# Altium schematic sheet PC CONNECTIONS.SchDoc
size A4
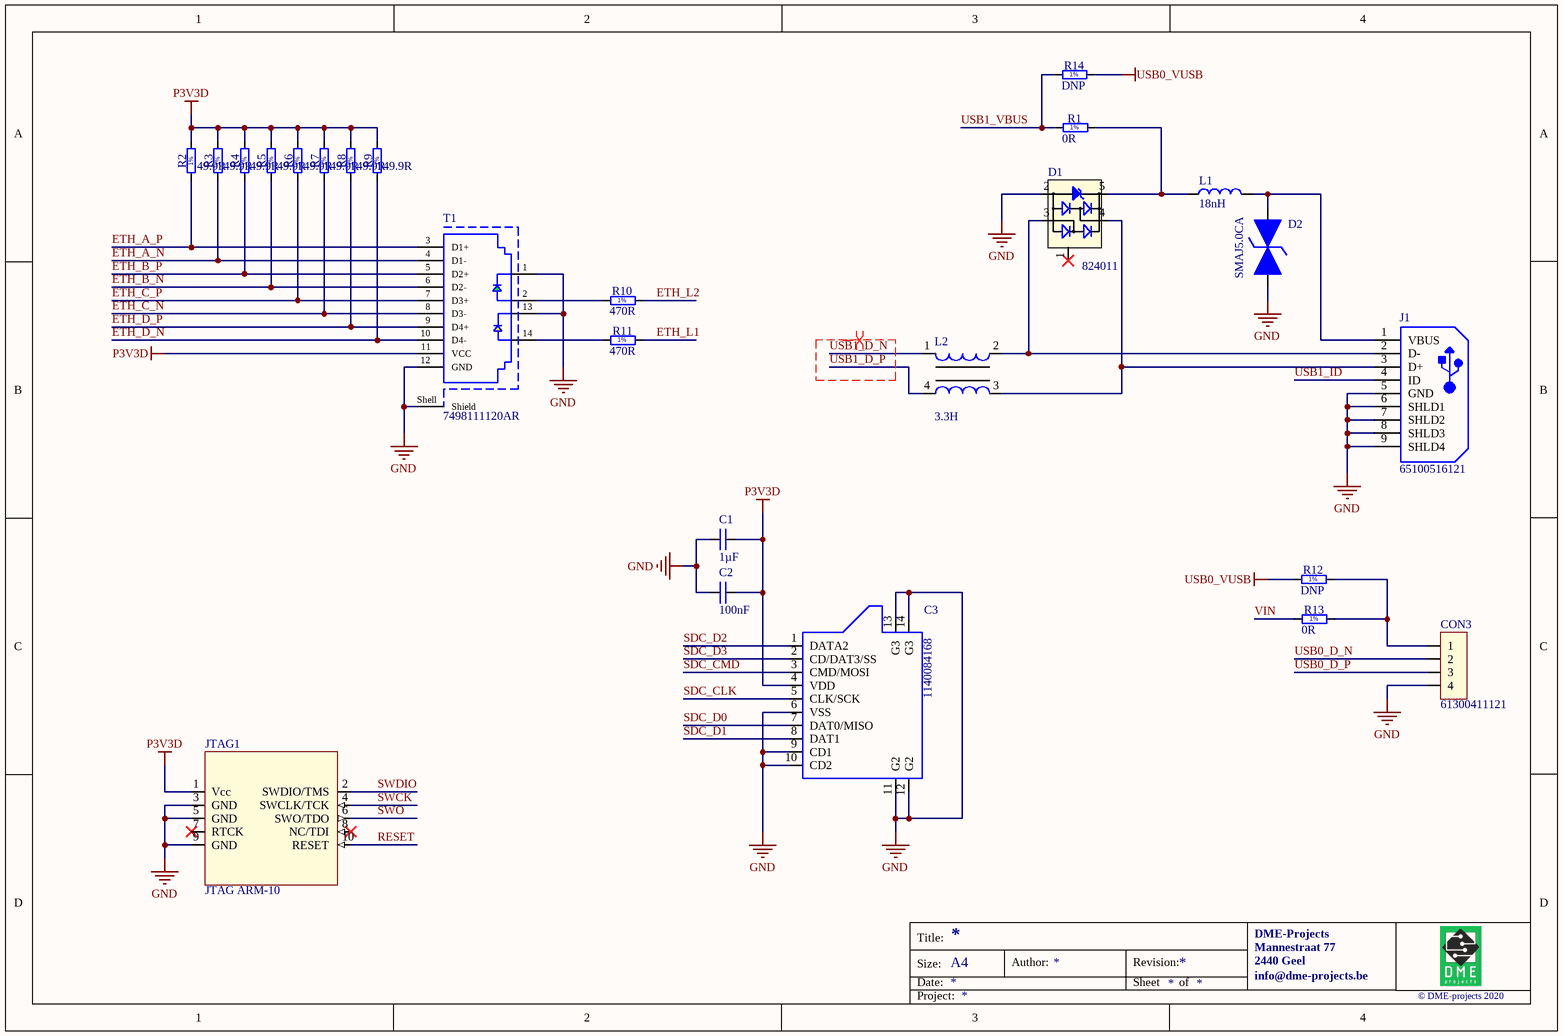
[diagram p0: PC CONNECTIONS.SchDoc]

## Parts
C1  value 1µF  [C0603]  (hidden comment: 447)
C2  value 100nF  [C0603]  (hidden comment: 423)
C3  1140084168  [Amphenol_MicroSD_Connector]
CON3  61300411121  [61300411121]
D1  824011  [ATML-5TS1_N]
D2  SMAJ5.0CA  [FP-SMAJ-MFG]
J1  65100516121  [WE-65100516121_V]
JTAG1  JTAG ARM-10  [62501021621]
L1  Inductance: 18nH  [SMD-0603]  (hidden comment: 742792641)
L2  Inductance: 3.3H  [WE-CNSW-1206]  (hidden comment: 744232090)
R1  value 0R  [R0603]  (hidden comment: 1040)
R2  value 49.9R  [R0603]  (hidden comment: 1020)
R3  value 49.9R  [R0603]  (hidden comment: 1020)
R4  value 49.9R  [R0603]  (hidden comment: 1020)
R5  value 49.9R  [R0603]  (hidden comment: 1020)
R6  value 49.9R  [R0603]  (hidden comment: 1020)
R7  value 49.9R  [R0603]  (hidden comment: 1020)
R8  value 49.9R  [R0603]  (hidden comment: 1020)
R9  value 49.9R  [R0603]  (hidden comment: 1020)
R10  value 470R  [R0603]  (hidden comment: 427)
R11  value 470R  [R0603]  (hidden comment: 427)
R12  value DNP  [R0603]  (hidden comment: 1041)
R13  value 0R  [R0603]  (hidden comment: 1040)
R14  value DNP  [R0603]  (hidden comment: 1041)
T1  7498111120AR  [7498111120AR]

## Nets
GND: C1.2 C2.1 C3.6(VSS) C3.9(CD1) C3.10(CD2) C3.11(G2) C3.12(G2) C3.13(G3) C3.14(G3) CON3.4 D1.2(GND) D2.1 J1.5(GND) J1.6(SHLD1) J1.7(SHLD2) J1.8(SHLD3) J1.9(SHLD4) JTAG1.3(GND) JTAG1.5(GND) JTAG1.9(GND) T1.1 T1.12(GND) T1.13 T1.Shell(Shield)
P3V3D: C1.1 C2.2 C3.4(VDD) JTAG1.1(Vcc) R2.2 R3.2 R4.2 R5.2 R6.2 R7.2 R8.2 R9.2 T1.11(VCC)
USB0_VUSB: R12.1 R14.2
ETH_A_N: R3.1 T1.4(D1-)
ETH_A_P: R2.1 T1.3(D1+)
ETH_B_N: R5.1 T1.6(D2-)
ETH_B_P: R4.1 T1.5(D2+)
ETH_C_N: R7.1 T1.8(D3-)
ETH_C_P: R6.1 T1.7(D3+)
ETH_D_N: R9.1 T1.10(D4-)
ETH_D_P: R8.1 T1.9(D4+)
ETH_L1: R11.2
ETH_L2: R10.2
RESET: JTAG1.10(RESET)
SDC_CLK: C3.5(CLK/SCK)
SDC_CMD: C3.3(CMD/MOSI)
SDC_D0: C3.7(DAT0/MISO)
SDC_D1: C3.8(DAT1)
SDC_D2: C3.1(DATA2)
SDC_D3: C3.2(CD/DAT3/SS)
SWCK: JTAG1.4(SWCLK/TCK)
SWDIO: JTAG1.2(SWDIO/TMS)
SWO: JTAG1.6(SWO/TDO)
USB0_D_N: CON3.2
USB0_D_P: CON3.3
USB1_D_N: L2.1
USB1_D_P: L2.4
USB1_ID: J1.4(ID)
USB1_VBUS: R1.1 R14.1
VIN: R13.1
NetCON3_1: CON3.1 R12.2 R13.2
NetD1_3: D1.3(I/O1) J1.2(D-) L2.2
NetD1_4: D1.4(I/O2) J1.3(D+) L2.3
NetD1_5: D1.5(VDD) L1.1 R1.2
NetD2_2: D2.2 J1.1(VBUS) L1.2
NetR10_1: R10.1 T1.2
NetR11_1: R11.1 T1.14

Not connected (* = marked no-connect by the designer): D1 1(NC)*; JTAG1 7(RTCK)* 8(NC/TDI)*

## Layout directives
differential pair: USB1_D_N, USB1_D_P

## Notes on the sheet
- Title:
- Size:
- Date:
- A4
- Author:
- Revision:
- Sheet
- of
- DME-Projects
- Mannestraat 77
- 2440 Geel
- info@dme-projects.be
- Project:
- © DME-projects 2020
- (in symbol CMP-209-0426-1) 1%
- (in symbol CMP-209-1019-1) 1%
- (in symbol CMP-209-1037-1) 1%
- (in symbol CMP-209-1038-1) 1%

## Library data of the parts
C1 = CMP-208-0446-2: generic 0603 capacitor; Type: Ceramic; Tolerance: 0.05; Voltage: 25V; MFG no: generic; MFG: generic
C2 = CMP-208-0422-4: generic 0603 capacitor; Tolerance: 0.05; Voltage: 50V; Type: Ceramic; MFG no: generic; MFG: generic
C3 = CMP-00036-2: Micro SD; Conn; IC Socket; ; Right Angle; PCB Mount; MicroSD Ser.; Gender: Receptacle; Pitch: 1.1mm; Number of Contacts: 8; Connector Type: Connector; Housing Material: Polymer; Package Quantity: 7500; Length: 15.6mm; Lead Free: Lead Free; Packaging: Tape and Reel; Termination: SMD/SMT; Mount: Surface Mount; Depth: 11.45mm; Contact Material: Copper Alloy,Copper; Radiation Hardening: No; Number of Rows: 1; Height: 1.55mm; Orientation: Right Angle; Contact Plating: Gold; Flammability Rating: UL94 V-0; REACH SVHC: Unknown
CON3 = CMP-00034-1: CONN HEADER VERT 4POS 2.54MM; Gender: Male; Number of Contacts: 4; Connector Type: Male Pin; Pitch: 0.1inch; Lead Free: Lead Free; Contact Material: Copper; Contact Mating Length: 0.236inch; Number of Rows: 1; REACH SVHC: Unknown; Number of Positions: 4; Packaging: Bulk; Mount: Through Hole; Contact Plating: Gold; Termination: Solder; Color: Black
D1 = CMP-004-00034-3: Trans Voltage Suppressor Diode, 5V V(RWM), Unidirectional, 1 Element, Silicon; Clamping Voltage: 8.5V; Test Current: 1mA; Max Surge Current: 12A; Power Line Protection: Yes; Max Reverse Leakage Current: 5A; Polarity: Bidirectional; Capacitance: 2pF; Number of Channels: 2; Min Breakdown Voltage: 6.1V; Operating Supply Voltage: 6V; Reverse Standoff Voltage: 5V; Packaging: Tape and Reel; Max Operating Temperature: 125°C; Working Voltage: 5V; Number of Pins: 5; Termination: SMD/SMT; Peak Pulse Current: 12A; Height: 1.16mm; Direction: Unidirectional; Mount: Surface Mount; Number of Bidirectional Channels: 2; ESD Protection: Yes; Breakdown Voltage: 6.1V; Max Breakdown Voltage: 6.1V; Length: 2.9mm; Case/Package: SOT-23; Package Quantity: 3000; REACH SVHC: Unknown; Min Operating Temperature: -55°C; Width: 2.8mm
D2 = CMP-00032-1: BOURNS - SMAJ5.0CA - TVS Diode, TRANSZORB SMAJ Series, Bidirectional, 5 V, 9.2 V, DO-214AC (SMA), 2 Pins; ESD Protection: Yes; Reverse Breakdown Voltage: 6.4V; Max Breakdown Voltage: 7V; Reverse Standoff Voltage: 5V; Number of Elements: 1; Diode Type: ZENER; Test Current: 10mA; Leakage Current: 1.6mA; Max Surge Current: 40A; Element Configuration: Single; Peak Pulse Power: 400W; Peak Pulse Current: 43.5A; Power Line Protection: No; Clamping Voltage: 9.2V; Case/Package: DO-214AC; Termination: SMD/SMT; Radiation Hardening: No; Polarity: Bidirectional; Direction: Bidirectional; Number of Channels: 1; Packaging: Tape and Reel; Min Operating Temperature: -55°C; Max Operating Temperature: 150°C; Max Reverse Leakage Current: 1.6mA; Breakdown Voltage: 7V; REACH SVHC: No SVHC; Series: SMAJ; Contact Plating: Tin; Number of Bidirectional Channels: 1; Resistor Type: Zener; Operating Supply Voltage: 5V; Package Quantity: 1; Max Power Dissipation: 400W; Number of Pins: 2; Min Breakdown Voltage: 6.4V; Mount: Surface Mount
J1 = CMP-00031-1: CONN RCPT USB2.0 MINI B SMD R/A; Number of Ports: 1; Contact Resistance: 20mR; Number of Contacts: 5; Gender: Receptacle; Working Voltage: 30V; Connector Type: USB; Mating Cycles: 1500; Insulation Resistance: 1GR; Current Rating: 1A; USB Standard: USB 2.0; Length: 7.7mm; Contact Plating: Gold; Termination: Solder; Mount: Surface Mount,Horizontal; Max Operating Temperature: 105°C; Orientation: Right Angle; Color: Black; Contact Material: Copper Alloy; REACH SVHC: Unknown; Min Operating Temperature: -40°C; Number of Positions: 5; Packaging: Tape and Reel; Package Quantity: 500; Voltage Rating: 30V; Flammability Rating: UL94 V-0; Width: 9.25mm; Series: WR-COM; Lead Free: Lead Free
JTAG1 = CMP-002-00269-2: JTAG ARM 10 pin interface connector 2mm pitch
L1 = CMP-00033-1: FERRITE BEAD 300 OHM 0603 1LN; DC Resistance (DCR): 150mR; Impedance: 300R; Max Current Rating: 2A; Number of Lines: 1; Tolerance: 25%; Test Frequency: 100MHz; Case/Package: SMD/SMT; Min Operating Temperature: -55°C; Series: WE-CBF; Depth: 0.8mm; Height: 0.8mm; Core Material: Ferrite; Width: 0.8mm; Packaging: Tape and Reel; Length: 1.6mm; Case Code (Metric): 1608; Lead Free: Lead Free; Case Code (Imperial): 0603; Max DC Current: 2A; REACH SVHC: Unknown; Max Operating Temperature: 125°C; Package Quantity: 1; Current Rating: 2A; Mount: Surface Mount; Weight: 0.000141oz; Termination: SMD/SMT; Material: Ferrite
L2 = CMP-006-00021-2: Data Line Filter, 2 Function(s), 50V, 0.37A; Test Frequency: 100MHz; Resistance: 300mR; Max DC Current: 370mA; Tolerance: 25%; Number of Lines: 2; Impedance: 90R; Core Material: Ferrite; Length: 3.2mm; Weight: 0.001376oz; DC Resistance (DCR): 300mR; Current Rating: 370mA; Mount: Surface Mount; Frequency: 100MHz; Height: 0.083inch; Min Operating Temperature: -40°C; Max Current Rating: 370mA; Max Operating Temperature: 125°C; Current: 370mA; Voltage Rating (DC): 50V; REACH SVHC: No SVHC; Termination: SMD/SMT; Depth: 1.6mm; Voltage Rating: 50V; Width: 1.6mm; Packaging: Tape and Reel; Lead Free: Lead Free; Case/Package: 1206; Package Quantity: 1
R1 R13 = CMP-209-1037-1: generic 0603 Thick film resistor; Power: 100mW; Tolerance: 0.01; Voltage: 75V; Type: Thick film; MFG: generic; MFG no: generic
R2-R9 = CMP-209-1019-1: generic 0603 Thick film resistor; Voltage: 75V; Tolerance: 0.01; Power: 100mW; MFG: generic; Type: Thick film; MFG no: generic
R10 R11 = CMP-209-0426-1: generic 0603 Thick film resistor; Power: 100mW; Tolerance: 0.01; Voltage: 75V; Type: Thick film; MFG no: generic; MFG: generic
R12 R14 = CMP-209-1038-1: generic 0603 Thick film resistor; Voltage: 75V; Power: 100mW; MFG no: generic; Type: Thick film; MFG: generic
T1 = CMP-217-0000-1: WE-RJ45 LAN Transformer, SMT, 10/100/1000 Base-T, Port 1x1, Tab Up; Manufacturer: Wurth Elektronik; USB: No; PoE: non-PoE; LED: yellow-green; Shield Tabs: Yes; ComponentLink2Description: Datasheet; Source: WE-RJ45 LAN.SchLib; Packaging: Tape and Reel; ComponentLink1URL: http://www.we-online.de; HPLE: No; Design Item ID: 7498111120AR; Data Rate: 10/100/1000 Base-T; Port Number: 1x1; ComponentLink1Description: Manufacturer; Operating Temperature: 0 to +70degC; Published Date: October 2020; Mounting Technology: SMT; ComponentLink2URL: https://www.we-online.com/catalog/datasheet/7498111120AR.pdf; Manufacturer Part Number: 7498111120AR; Tab: Up